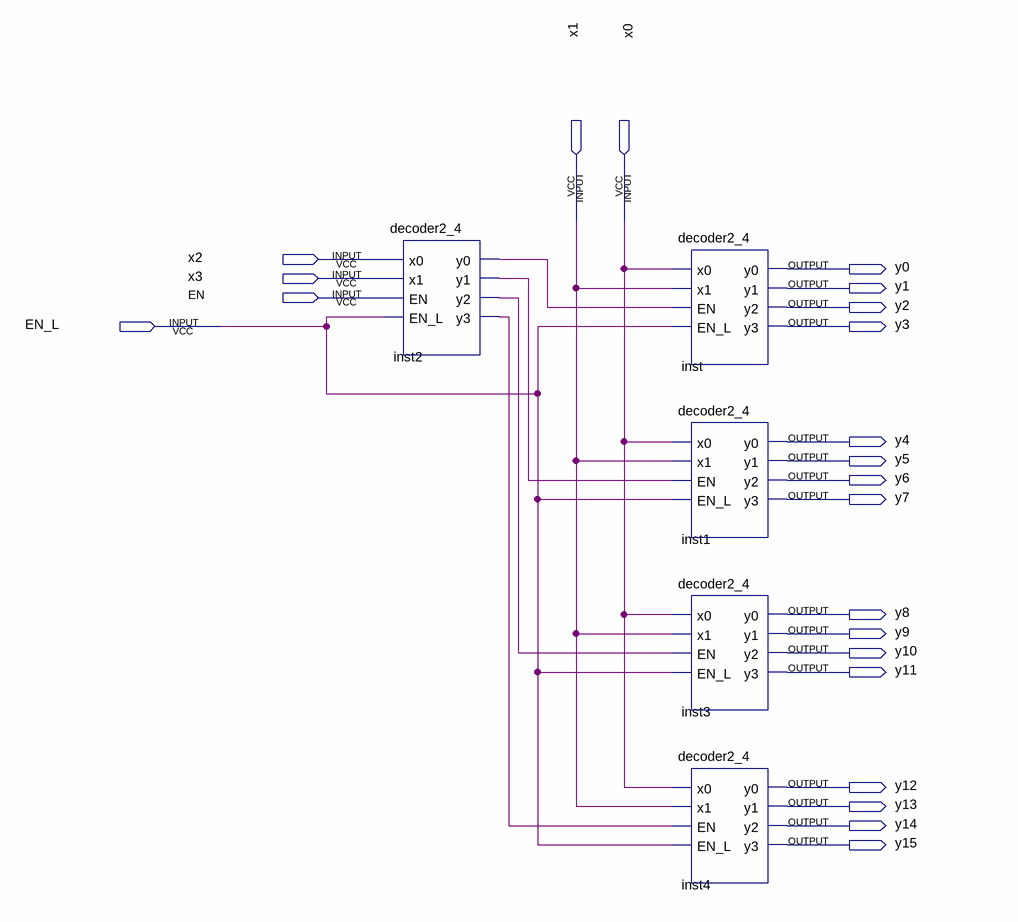
[diagram p0: schematic sheet]
// Quartus schematic Dec4_16_2.bdf as structural Verilog: 5 symbols, 22 pins
module Dec4_16_2 (
  input  x1,
  input  x0,
  input  x2,
  input  x3,
  input  EN,
  input  EN_L,
  output y0,
  output y1,
  output y2,
  output y3,
  output y4,
  output y5,
  output y6,
  output y7,
  output y8,
  output y9,
  output y10,
  output y11,
  output y12,
  output y13,
  output y14,
  output y15
);

  wire inst2_y0, inst2_y1, inst2_y2, inst2_y3;

  decoder2_4 inst2 (.x0(x2), .x1(x3), .EN(EN), .EN_L(EN_L), .y0(inst2_y0), .y1(inst2_y1), .y2(inst2_y2), .y3(inst2_y3));
  decoder2_4 inst (.x0(x0), .x1(x1), .EN(inst2_y0), .EN_L(EN_L), .y0(y0), .y1(y1), .y2(y2), .y3(y3));
  decoder2_4 inst1 (.x0(x0), .x1(x1), .EN(inst2_y1), .EN_L(EN_L), .y0(y4), .y1(y5), .y2(y6), .y3(y7));
  decoder2_4 inst3 (.x0(x0), .x1(x1), .EN(inst2_y2), .EN_L(EN_L), .y0(y8), .y1(y9), .y2(y10), .y3(y11));
  decoder2_4 inst4 (.x0(x0), .x1(x1), .EN(inst2_y3), .EN_L(EN_L), .y0(y12), .y1(y13), .y2(y14), .y3(y15));
endmodule
